# Altium project PWR.PrjPcb
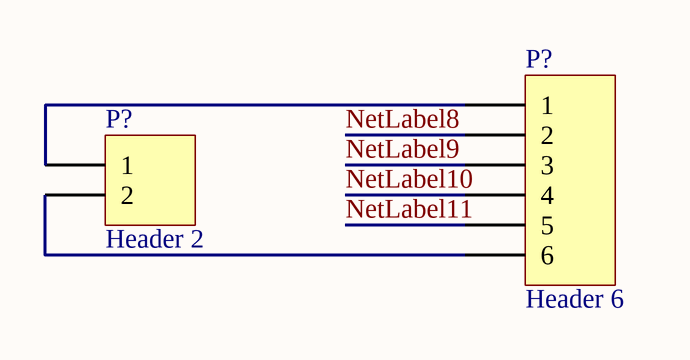
[diagram p0: Sheet1.SchDoc]
1 sheet, 2 parts. Net scope: global (net labels, ports and power ports of the same name join across sheets).
Board file: PCB1.PcbDoc

## Sheet Sheet1.SchDoc
size A4

### Parts
(Parts that share a designator on the sheet are numbered #1, #2 ... from top to bottom, then left to right.)
P?#1  Header 6  [HDR1X6]
P?#2  Header 2  [XT60_H]

### Nets
NetLabel8: P?#1.2
NetLabel9: P?#1.3
NetLabel10: P?#1.4
NetLabel11: P?#1.5
NetP?#1_1: P?#1.1 P?#2.1
NetP?#1_6: P?#1.6 P?#2.2

### Library data of the parts
P?#1 = Header 6: Header, 6-Pin; LatestRevisionDate: 17-Jul-2002; LatestRevisionNote: Re-released for DXP Platform.; Publisher: Altium Limited
P?#2 = Header 2: Header, 2-Pin; LatestRevisionDate: 17-Jul-2002; LatestRevisionNote: Re-released for DXP Platform.; Publisher: Altium Limited